# EAGLE schematic ring counter (EAGLE 6.0)
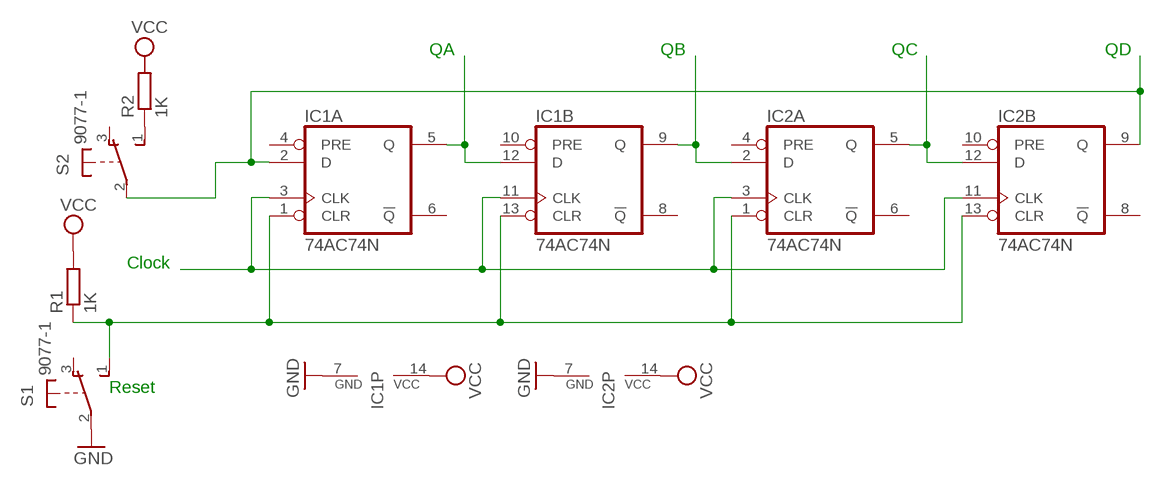
[diagram p0: schematic, sheet 1]

## Parts
IC1  74AC74N  [DIL14]
IC2  74AC74N  [DIL14]
R1  1K  R-EU_0204/7  [0204/7]
R2  1K  R-EU_0204/7  [0204/7]
S1  9077-1  [9077-1]
S2  9077-1  [9077-1]

## Nets
CLOCK: IC1.3(A:CLK) IC1.11(B:CLK) IC2.3(A:CLK) IC2.11(B:CLK)
GND: IC1.7(P:GND) IC2.7(P:GND) S1.2(P)
N$1: IC1.5(A:Q) IC1.12(B:D)
N$2: IC1.9(B:Q) IC2.2(A:D)
N$3: IC2.5(A:Q) IC2.12(B:D)
N$4: R2.1 S2.1(S)
N$5: IC1.2(A:D) IC2.9(B:Q) S2.2(P)
N$6: IC1.1(A:CLR) IC1.13(B:CLR) IC2.1(A:CLR) IC2.13(B:CLR) R1.1 S1.1(S)
VCC: IC1.14(P:VCC) IC2.14(P:VCC) R1.2
Unconnected: IC1.4(A:PRE) IC1.6(A:!Q) IC1.8(B:!Q) IC1.10(B:PRE) IC2.4(A:PRE) IC2.6(A:!Q) IC2.8(B:!Q) IC2.10(B:PRE) R2.2 S1.3(O) S2.3(O)

## Notes on the sheet
- QA | QB | QC | QD
- Clock
- Reset

## Library data of the parts
IC1 IC2 = 74xx-eu:74*74: Dual D type positive edge triggered FLIP FLOP, preset and clear
R1 R2 = rcl:R-EU_: RESISTOR, European symbol
S1 S2 = switch-misc:9077-1: MARQUARDT SWITCH 9077.0100 Distributor: Buerklin <https://www.buerklin.com/default.asp?event=ShowArtikel%2812G2820%29&l=d&jump=ArtNr_12G2820>